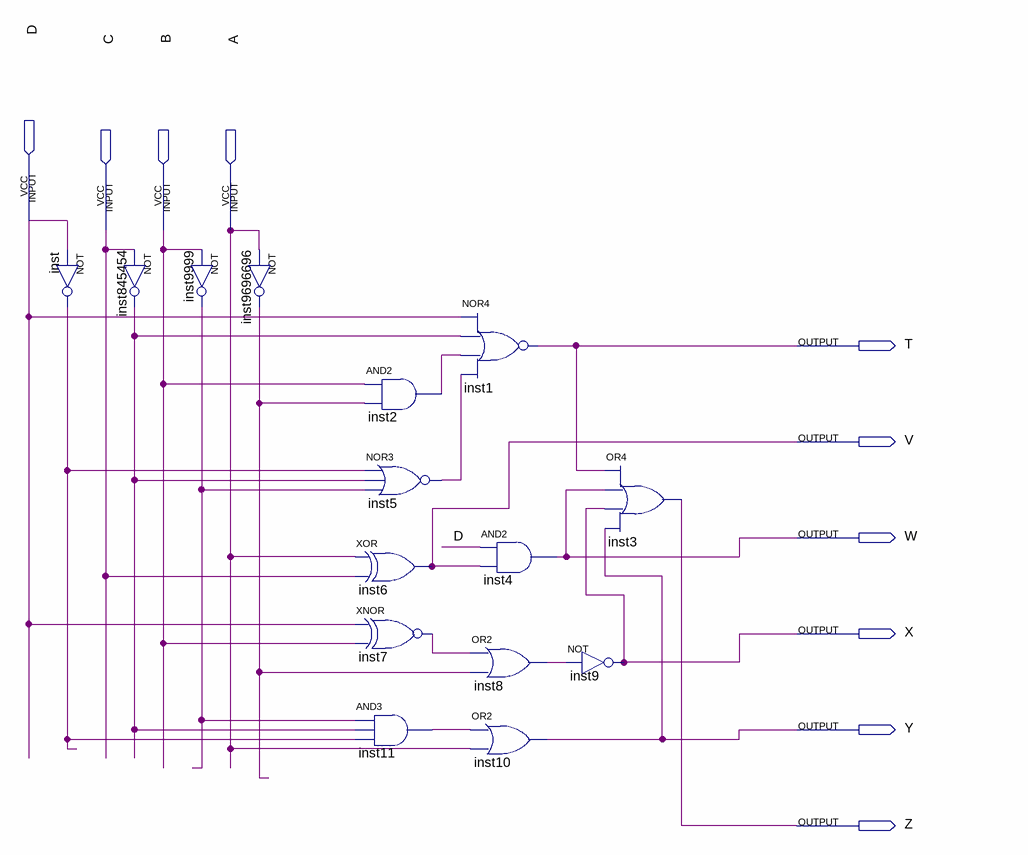
[diagram p0: schematic sheet]
// Quartus schematic Lab1_2A.bdf as structural Verilog: 15 symbols, 10 pins
module Lab1_2A (
  input  D,
  input  C,
  input  B,
  input  A,
  output T,
  output V,
  output W,
  output X,
  output Y,
  output Z
);

  wire inst2_out, inst5_out, inst7_out, inst8_out, inst11_out, inst9999_out, inst845454_out, inst9696696_out,
       inst_out;

  not inst (inst_out, D);
  not inst845454 (inst845454_out, C);
  not inst9999 (inst9999_out, B);
  not inst9696696 (inst9696696_out, A);
  and inst2 (inst2_out, B, inst9696696_out);
  nor inst5 (inst5_out, inst_out, inst845454_out, inst9999_out);
  xor inst6 (V, A, C);
  xnor inst7 (inst7_out, D, B);
  and inst11 (inst11_out, inst9999_out, inst845454_out, inst_out);
  nor inst1 (T, D, inst845454_out, inst2_out, inst5_out);
  and inst4 (W, D, V);
  or inst8 (inst8_out, inst7_out, inst9696696_out);
  or inst10 (Y, inst11_out, A);
  or inst3 (Z, T, W, X, Y);
  not inst9 (X, inst8_out);
endmodule
